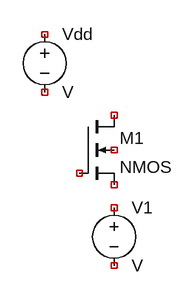
[diagram p0: schematic Draft1.asc]
Draft1.asc, the LTspice schematic file:
Version 4
SHEET 1 880 680
SYMBOL nmos4 144 128 R0
SYMATTR InstName M1
SYMBOL voltage 192 240 R0
SYMATTR InstName V1
SYMBOL voltage 96 0 R0
SYMATTR InstName Vdd

The netlist it stands for:
* Draft1.asc
M1 NC_01 NC_02 NC_03 NC_04 NMOS
V1 NC_05 NC_06 V
Vdd NC_07 NC_08 V
.model NMOS NMOS
.model PMOS PMOS
.lib standard.mos
.backanno
.end